# Altium project PROC154E3_SCH.PrjPcb (part 17 of 60)

## Sheet 23. SOC IO & SUPPORT POWER 2.SchDoc: SOC - DIGITAL & SUPPORT POWER 2
size 513 x 386 mm; Project: PROC154E2(001)_SK_AM69; Issue: 1.0; RevCode: E3; Page Create Date: March  8, 1995; Variant Name: Core Design; Schematic Page Number: 23; Page Number: 23; Page Size: C; Comment: MISTRAL_TITLEBLK_CSIZE_1; Page Count: 62; Schematic Page Count: 62; Name: PROC154E2 001 SK AM69; DsnPath: C:\Users\danie\Downloads\sprr466c\PROC154E3_RP\PROC154E3_SCH.DSN; SchematicName: SCHEMATIC1; PageName: 23. SOC IO & SUPPORT POWER 2; PageSize: C; TopSchematic: True
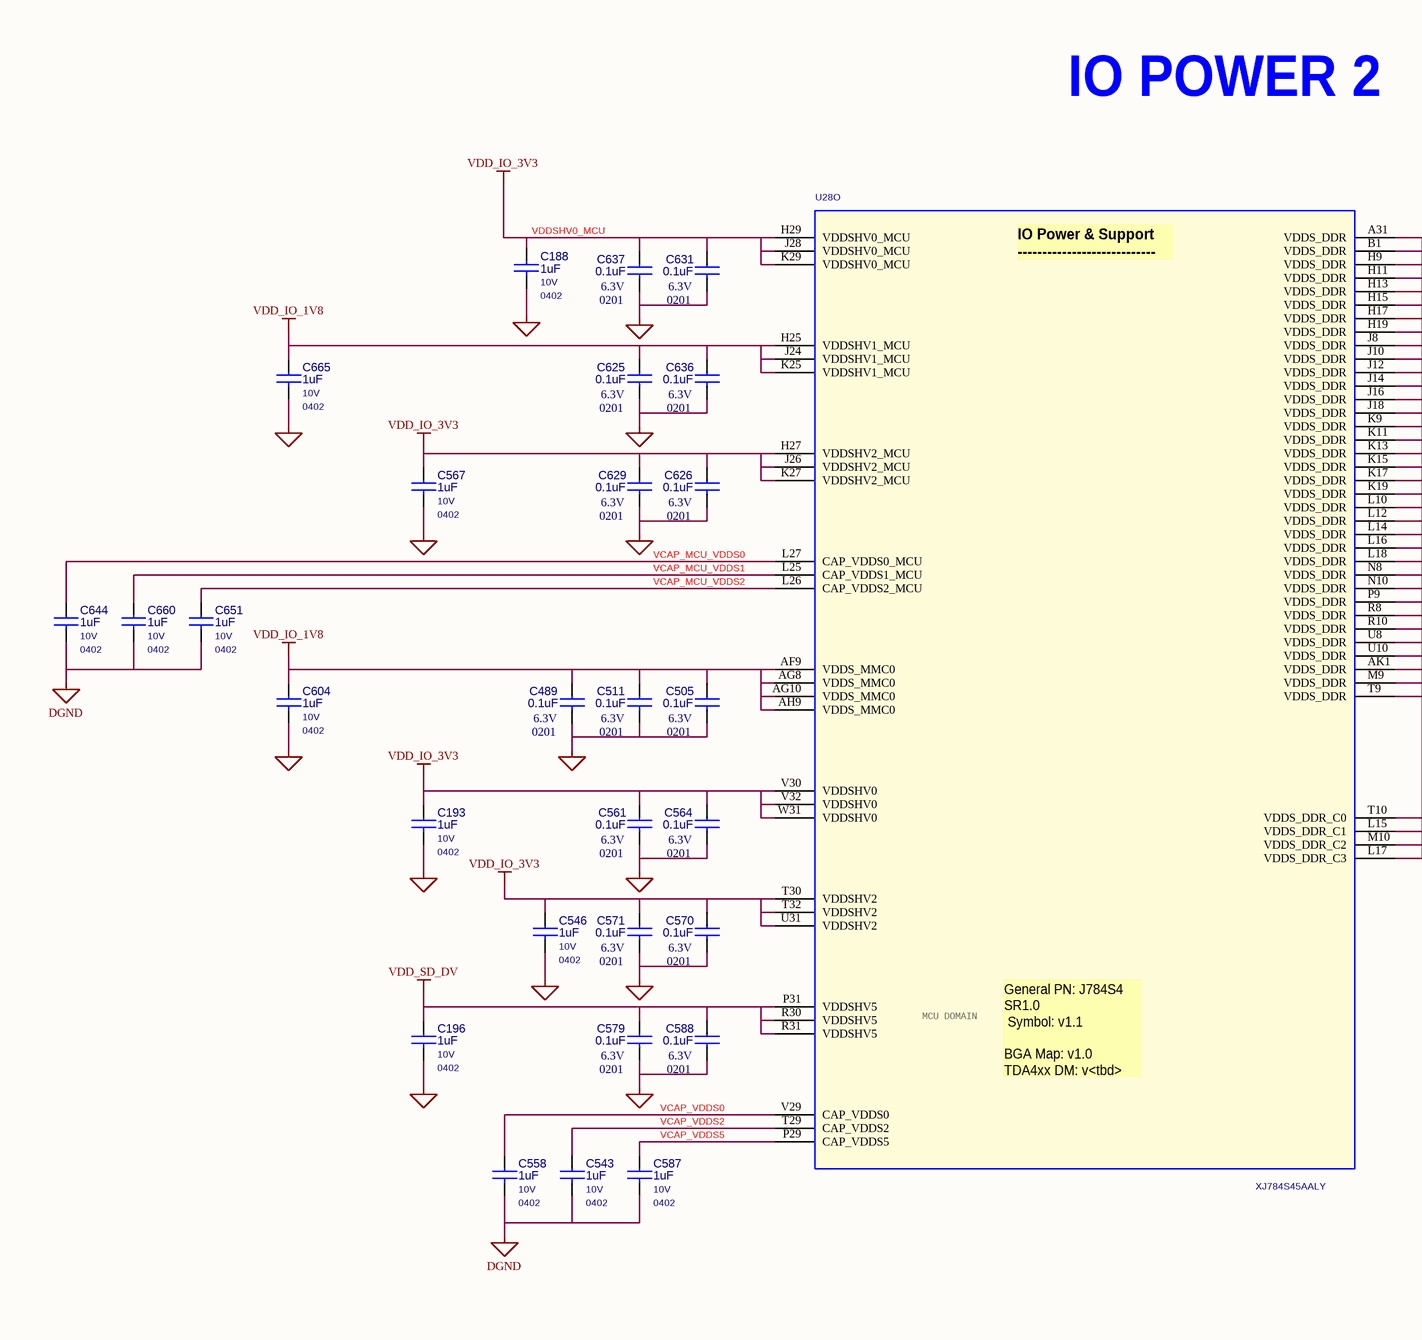
[diagram p34: 23. SOC IO & SUPPORT POWER 2.SchDoc, left]
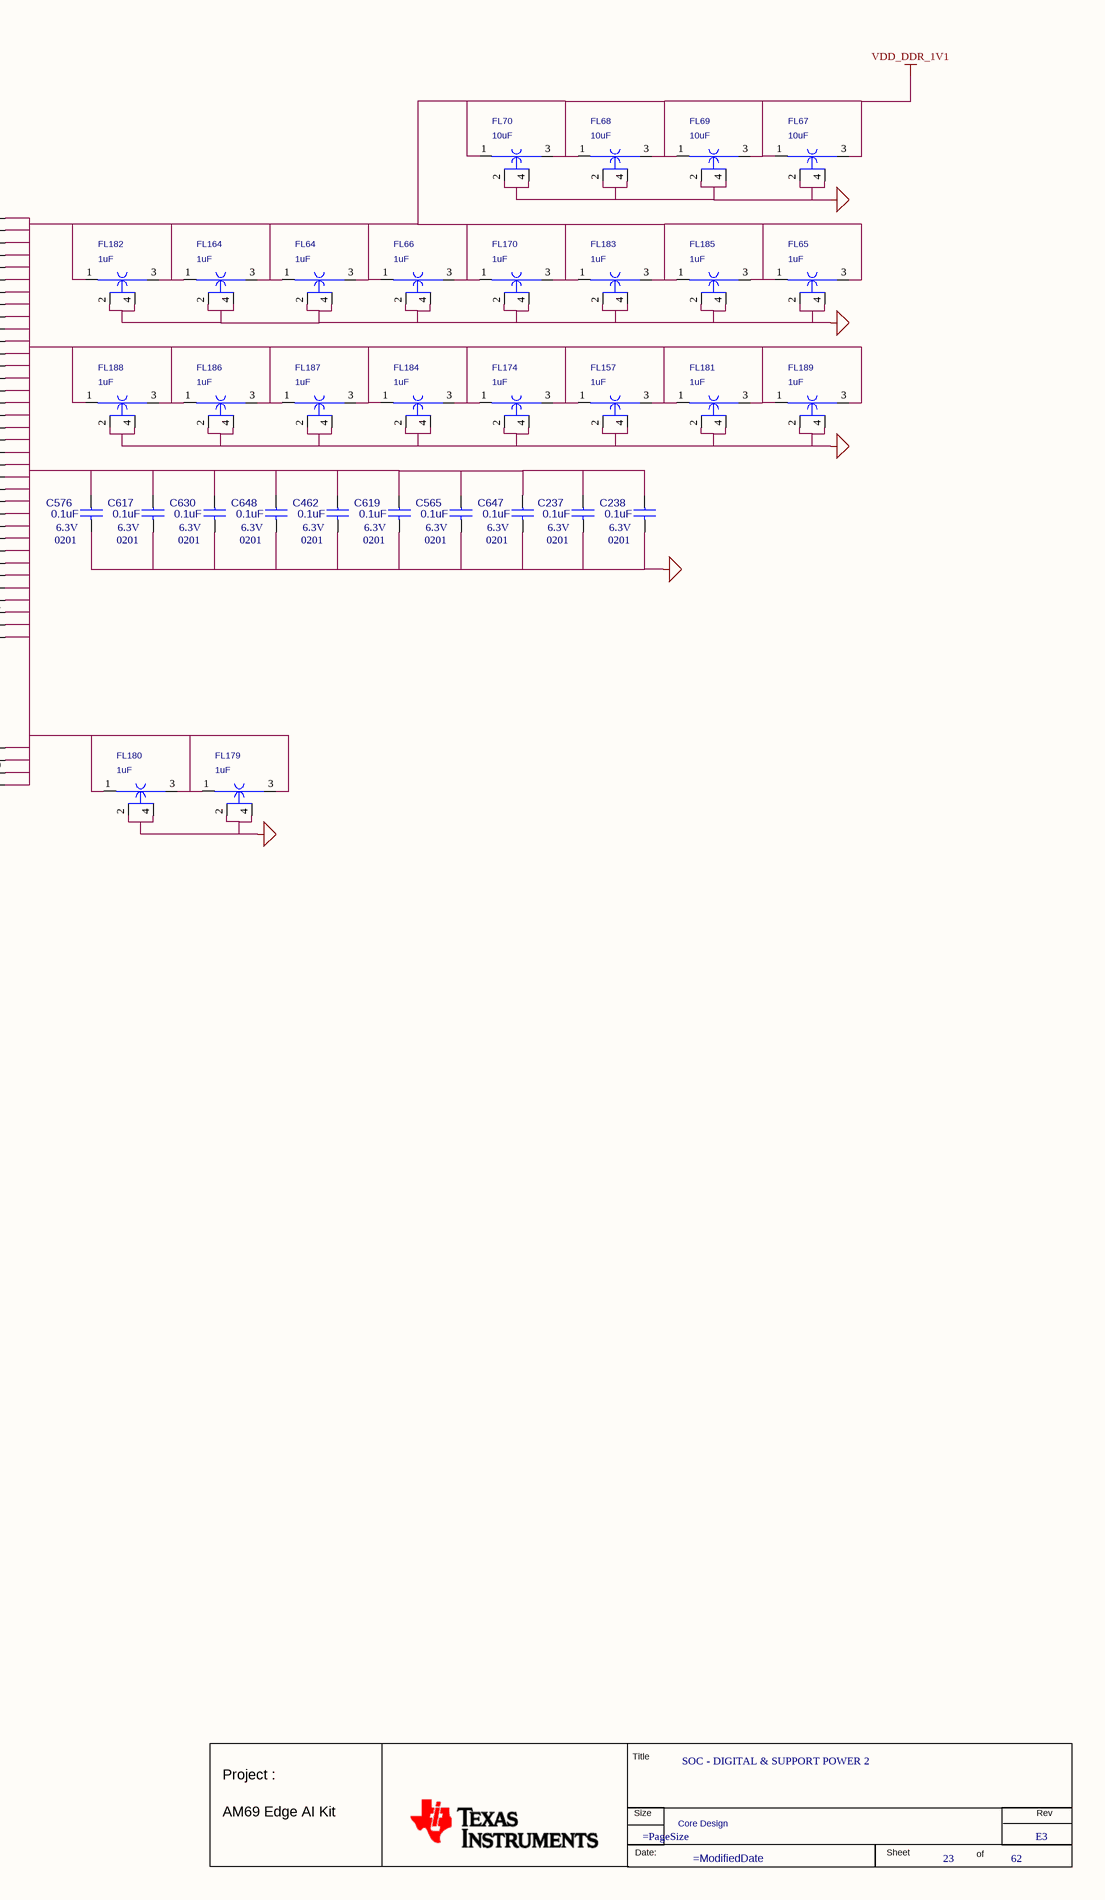
[diagram p35: 23. SOC IO & SUPPORT POWER 2.SchDoc, right]

### Parts
(Parts that share a designator on the sheet are numbered #1, #2 ... from top to bottom, then left to right.)
*#23  RevCode: E3  Title: SOC - DIGITAL & SUPPORT POWER 2  Page Number: 23  Page Count: 62  Variant Name: Core Design  (hidden comment: MISTRAL_TITLEBLK_CSIZE_1)  (graphical)
C188  1uF  Voltage: 10V  Package: 0402  [CAP0402_0-75]
C193  1uF  Voltage: 10V  Package: 0402  [CAP0402_0-75]
C196  1uF  Package: 0402  Voltage: 10V  [CAP0402_0-75]
C237  0.1uF  Voltage: 6.3V  Package: 0201  [CAP0201_0-5]
C238  0.1uF  Package: 0201  Voltage: 6.3V  [CAP0201_0-5]
C462  0.1uF  Package: 0201  Voltage: 6.3V  [CAP0201_0-5]
C489  0.1uF  Package: 0201  Voltage: 6.3V  [CAP0201_0-5]
C505  0.1uF  Voltage: 6.3V  Package: 0201  [CAP0201_0-5]
C511  0.1uF  Package: 0201  Voltage: 6.3V  [CAP0201_0-5]
C543  1uF  Package: 0402  Voltage: 10V  [CAP0402_0-75]
C546  1uF  Voltage: 10V  Package: 0402  [CAP0402_0-75]
C558  1uF  Package: 0402  Voltage: 10V  [CAP0402_0-75]
C561  0.1uF  Package: 0201  Voltage: 6.3V  [CAP0201_0-5]
C564  0.1uF  Voltage: 6.3V  Package: 0201  [CAP0201_0-5]
C565  0.1uF  Package: 0201  Voltage: 6.3V  [CAP0201_0-5]
C567  1uF  Voltage: 10V  Package: 0402  [CAP0402_0-75]
C570  0.1uF  Voltage: 6.3V  Package: 0201  [CAP0201_0-5]
C571  0.1uF  Package: 0201  Voltage: 6.3V  [CAP0201_0-5]
C576  0.1uF  Voltage: 6.3V  Package: 0201  [CAP0201_0-5]
C579  0.1uF  Voltage: 6.3V  Package: 0201  [CAP0201_0-5]
C587  1uF  Voltage: 10V  Package: 0402  [CAP0402_0-75]
C588  0.1uF  Package: 0201  Voltage: 6.3V  [CAP0201_0-5]
C604  1uF  Voltage: 10V  Package: 0402  [CAP0402_0-75]
C617  0.1uF  Package: 0201  Voltage: 6.3V  [CAP0201_0-5]
C619  0.1uF  Voltage: 6.3V  Package: 0201  [CAP0201_0-5]
C625  0.1uF  Package: 0201  Voltage: 6.3V  [CAP0201_0-5]
C626  0.1uF  Voltage: 6.3V  Package: 0201  [CAP0201_0-5]
C629  0.1uF  Package: 0201  Voltage: 6.3V  [CAP0201_0-5]
C630  0.1uF  Package: 0201  Voltage: 6.3V  [CAP0201_0-5]
C631  0.1uF  Voltage: 6.3V  Package: 0201  [CAP0201_0-5]
C636  0.1uF  Voltage: 6.3V  Package: 0201  [CAP0201_0-5]
C637  0.1uF  Package: 0201  Voltage: 6.3V  [CAP0201_0-5]
C644  1uF  Package: 0402  Voltage: 10V  [CAP0402_0-75]
C647  0.1uF  Voltage: 6.3V  Package: 0201  [CAP0201_0-5]
C648  0.1uF  Voltage: 6.3V  Package: 0201  [CAP0201_0-5]
C651  1uF  Voltage: 10V  Package: 0402  [CAP0402_0-75]
C660  1uF  Package: 0402  Voltage: 10V  [CAP0402_0-75]
C665  1uF  Package: 0402  Voltage: 10V  [CAP0402_0-75]
FL64  1uF  [EMIFIL_NFM15CC_0402_0-5_TI]
FL65  1uF  [EMIFIL_NFM15CC_0402_0-5_TI]
FL66  1uF  [EMIFIL_NFM15CC_0402_0-5_TI]
FL67  10uF  [EMIFIL_NFM18C_0603_0-7_TI]
FL68  10uF  [EMIFIL_NFM18C_0603_0-7_TI]
FL69  10uF  [EMIFIL_NFM18C_0603_0-7_TI]
FL70  10uF  [EMIFIL_NFM18C_0603_0-7_TI]
FL157  1uF  [EMIFIL_NFM15CC_0402_0-5_TI]
FL164  1uF  [EMIFIL_NFM15CC_0402_0-5_TI]
FL170  1uF  [EMIFIL_NFM15CC_0402_0-5_TI]
FL174  1uF  [EMIFIL_NFM15CC_0402_0-5_TI]
FL179  1uF  [EMIFIL_NFM15CC_0402_0-5_TI]
FL180  1uF  [EMIFIL_NFM15CC_0402_0-5_TI]
FL181  1uF  [EMIFIL_NFM15CC_0402_0-5_TI]
FL182  1uF  [EMIFIL_NFM15CC_0402_0-5_TI]
FL183  1uF  [EMIFIL_NFM15CC_0402_0-5_TI]
FL184  1uF  [EMIFIL_NFM15CC_0402_0-5_TI]
FL185  1uF  [EMIFIL_NFM15CC_0402_0-5_TI]
FL186  1uF  [EMIFIL_NFM15CC_0402_0-5_TI]
FL187  1uF  [EMIFIL_NFM15CC_0402_0-5_TI]
FL188  1uF  [EMIFIL_NFM15CC_0402_0-5_TI]
FL189  1uF  [EMIFIL_NFM15CC_0402_0-5_TI]
U28  XJ784S45AALY  [BGA1414_31-49_1230X1230_2-7]  (part O of 26)

### Nets
DGND: C188.2 C193.2 C196.2 C237.2 C238.2 C462.2 C489.2 C505.2 C511.2 C543.2 C546.2 C558.2 C561.2 C564.2 C565.2 C567.2 C570.2 C571.2 C576.2 C579.2 C587.2 C588.2 C604.2 C617.2 C619.2 C625.2 C626.2 C629.2 C630.2 C631.2 C636.2 C637.2 C644.2 C647.2 C648.2 C651.2 C660.2 C665.2 FL64.2 FL64.4 FL65.2 FL65.4 FL66.2 FL66.4 FL67.2 FL67.4 FL68.2 FL68.4 FL69.2 FL69.4 FL70.2 FL70.4 FL157.2 FL157.4 FL164.2 FL164.4 FL170.2 FL170.4 FL174.2 FL174.4 FL179.2 FL179.4 FL180.2 FL180.4 FL181.2 FL181.4 FL182.2 FL182.4 FL183.2 FL183.4 FL184.2 FL184.4 FL185.2 FL185.4 FL186.2 FL186.4 FL187.2 FL187.4 FL188.2 FL188.4 FL189.2 FL189.4  [project net VDD_CPU_HCPS_GOSNS]
VDD_DDR_1V1: C237.1 C238.1 C462.1 C565.1 C576.1 C617.1 C619.1 C630.1 C647.1 C648.1 FL64.1 FL64.3 FL65.1 FL65.3 FL66.1 FL66.3 FL67.1 FL67.3 FL68.1 FL68.3 FL69.1 FL69.3 FL70.1 FL70.3 FL157.1 FL157.3 FL164.1 FL164.3 FL170.1 FL170.3 FL174.1 FL174.3 FL179.1 FL179.3 FL180.1 FL180.3 FL181.1 FL181.3 FL182.1 FL182.3 FL183.1 FL183.3 FL184.1 FL184.3 FL185.1 FL185.3 FL186.1 FL186.3 FL187.1 FL187.3 FL188.1 FL188.3 FL189.1 FL189.3 U28.A31(VDDS_DDR) U28.AK1(VDDS_DDR) U28.B1(VDDS_DDR) U28.H9(VDDS_DDR) U28.H11(VDDS_DDR) U28.H13(VDDS_DDR) U28.H15(VDDS_DDR) U28.H17(VDDS_DDR) U28.H19(VDDS_DDR) U28.J8(VDDS_DDR) U28.J10(VDDS_DDR) U28.J12(VDDS_DDR) U28.J14(VDDS_DDR) U28.J16(VDDS_DDR) U28.J18(VDDS_DDR) U28.K9(VDDS_DDR) U28.K11(VDDS_DDR) U28.K13(VDDS_DDR) U28.K15(VDDS_DDR) U28.K17(VDDS_DDR) U28.K19(VDDS_DDR) U28.L10(VDDS_DDR) U28.L12(VDDS_DDR) U28.L14(VDDS_DDR) U28.L15(VDDS_DDR_C1) U28.L16(VDDS_DDR) U28.L17(VDDS_DDR_C3) U28.L18(VDDS_DDR) U28.M9(VDDS_DDR) U28.M10(VDDS_DDR_C2) U28.N8(VDDS_DDR) U28.N10(VDDS_DDR) U28.P9(VDDS_DDR) U28.R8(VDDS_DDR) U28.R10(VDDS_DDR) U28.T9(VDDS_DDR) U28.T10(VDDS_DDR_C0) U28.U8(VDDS_DDR) U28.U10(VDDS_DDR)
VDD_IO_1V8: C489.1 C505.1 C511.1 C604.1 C625.1 C636.1 C665.1 U28.AF9(VDDS_MMC0) U28.AG8(VDDS_MMC0) U28.AG10(VDDS_MMC0) U28.AH9(VDDS_MMC0) U28.H25(VDDSHV1_MCU) U28.J24(VDDSHV1_MCU) U28.K25(VDDSHV1_MCU)
VDD_SD_DV: C196.1 C579.1 C588.1 U28.P31(VDDSHV5) U28.R30(VDDSHV5) U28.R31(VDDSHV5)
VDDSHV0_MCU: C188.1 C193.1 C546.1 C561.1 C564.1 C567.1 C570.1 C571.1 C626.1 C629.1 C631.1 C637.1 U28.H27(VDDSHV2_MCU) U28.H29(VDDSHV0_MCU) U28.J26(VDDSHV2_MCU) U28.J28(VDDSHV0_MCU) U28.K27(VDDSHV2_MCU) U28.K29(VDDSHV0_MCU) U28.T30(VDDSHV2) U28.T32(VDDSHV2) U28.U31(VDDSHV2) U28.V30(VDDSHV0) U28.V32(VDDSHV0) U28.W31(VDDSHV0)  [also labelled VDD_IO_3V3]
VCAP_MCU_VDDS0: C644.1 U28.L27(CAP_VDDS0_MCU)
VCAP_MCU_VDDS1: C660.1 U28.L25(CAP_VDDS1_MCU)
VCAP_MCU_VDDS2: C651.1 U28.L26(CAP_VDDS2_MCU)
VCAP_VDDS0: C558.1 U28.V29(CAP_VDDS0)
VCAP_VDDS2: C543.1 U28.T29(CAP_VDDS2)
VCAP_VDDS5: C587.1 U28.P29(CAP_VDDS5)

### Notes on the sheet
- IO POWER 2
- (near U28) MCU DOMAIN
- (in symbol J7AHPSoC-EVM_BGA1414, part O) IO Power & Support / ----------------------------; General PN: J784S4 / SR1.0 / Symbol: v1.1 / BGA Map: v1.0 / TDA4xx DM: v<tbd>
- (in symbol MISTRAL_TITLEBLK_CSIZE_1) Title; Project :; Size; Rev; AM69 Edge AI Kit; Date:; Sheet; of